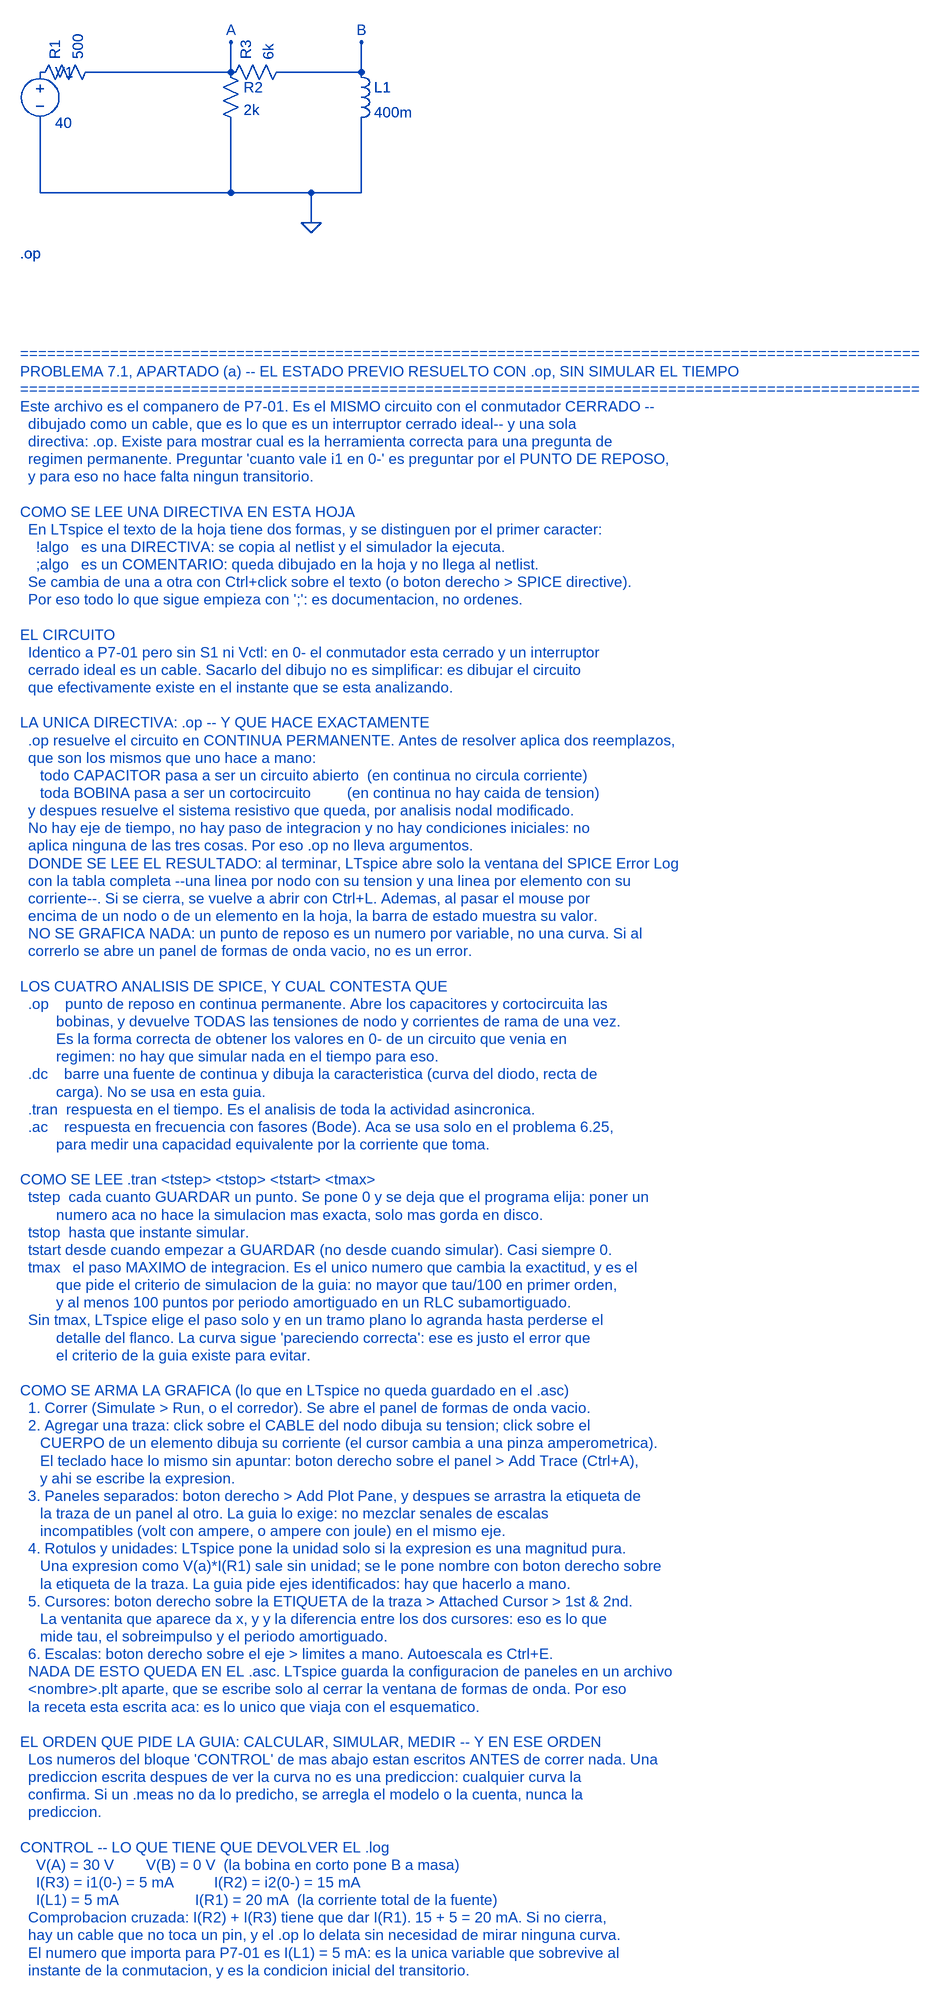
[diagram p0: schematic P7-01b_estado_previo_con_op.asc]
P7-01b_estado_previo_con_op.asc, the LTspice schematic file:
Version 4
SHEET 1 1800 1800
WIRE 96 192 96 304
WIRE 176 112 400 112
WIRE 400 192 400 304
WIRE 480 112 608 112
WIRE 608 192 608 304
WIRE 96 304 608 304
WIRE 528 304 528 352
WIRE 400 112 400 64
WIRE 608 112 608 64
FLAG 528 352 0
FLAG 400 64 A
FLAG 608 64 B
SYMBOL voltage 96 96 R0
WINDOW 123 0 0 Left 0
WINDOW 39 0 0 Left 0
SYMATTR InstName V1
SYMATTR Value 40
SYMBOL res 80 128 R270
SYMATTR InstName R1
SYMATTR Value 500
SYMBOL res 384 96 R0
SYMATTR InstName R2
SYMATTR Value 2k
SYMBOL res 384 128 R270
SYMATTR InstName R3
SYMATTR Value 6k
SYMBOL ind 592 96 R0
SYMATTR InstName L1
SYMATTR Value 400m
SYMATTR Value2 Rser=0
TEXT 64 400 Left 2 !.op
TEXT 64 560 Left 2 ;====================================================================================================
TEXT 64 588 Left 2 ;PROBLEMA 7.1, APARTADO (a) -- EL ESTADO PREVIO RESUELTO CON .op, SIN SIMULAR EL TIEMPO
TEXT 64 616 Left 2 ;====================================================================================================
TEXT 64 644 Left 2 ;Este archivo es el companero de P7-01. Es el MISMO circuito con el conmutador CERRADO --
TEXT 64 672 Left 2 ;  dibujado como un cable, que es lo que es un interruptor cerrado ideal-- y una sola
TEXT 64 700 Left 2 ;  directiva: .op. Existe para mostrar cual es la herramienta correcta para una pregunta de
TEXT 64 728 Left 2 ;  regimen permanente. Preguntar 'cuanto vale i1 en 0-' es preguntar por el PUNTO DE REPOSO,
TEXT 64 756 Left 2 ;  y para eso no hace falta ningun transitorio.
TEXT 64 784 Left 2 ;
TEXT 64 812 Left 2 ;COMO SE LEE UNA DIRECTIVA EN ESTA HOJA
TEXT 64 840 Left 2 ;  En LTspice el texto de la hoja tiene dos formas, y se distinguen por el primer caracter:
TEXT 64 868 Left 2 ;    !algo   es una DIRECTIVA: se copia al netlist y el simulador la ejecuta.
TEXT 64 896 Left 2 ;    ;algo   es un COMENTARIO: queda dibujado en la hoja y no llega al netlist.
TEXT 64 924 Left 2 ;  Se cambia de una a otra con Ctrl+click sobre el texto (o boton derecho > SPICE directive).
TEXT 64 952 Left 2 ;  Por eso todo lo que sigue empieza con ';': es documentacion, no ordenes.
TEXT 64 980 Left 2 ;
TEXT 64 1008 Left 2 ;EL CIRCUITO
TEXT 64 1036 Left 2 ;  Identico a P7-01 pero sin S1 ni Vctl: en 0- el conmutador esta cerrado y un interruptor
TEXT 64 1064 Left 2 ;  cerrado ideal es un cable. Sacarlo del dibujo no es simplificar: es dibujar el circuito
TEXT 64 1092 Left 2 ;  que efectivamente existe en el instante que se esta analizando.
TEXT 64 1120 Left 2 ;
TEXT 64 1148 Left 2 ;LA UNICA DIRECTIVA: .op -- Y QUE HACE EXACTAMENTE
TEXT 64 1176 Left 2 ;  .op resuelve el circuito en CONTINUA PERMANENTE. Antes de resolver aplica dos reemplazos,
TEXT 64 1204 Left 2 ;  que son los mismos que uno hace a mano:
TEXT 64 1232 Left 2 ;     todo CAPACITOR pasa a ser un circuito abierto  (en continua no circula corriente)
TEXT 64 1260 Left 2 ;     toda BOBINA pasa a ser un cortocircuito         (en continua no hay caida de tension)
TEXT 64 1288 Left 2 ;  y despues resuelve el sistema resistivo que queda, por analisis nodal modificado.
TEXT 64 1316 Left 2 ;  No hay eje de tiempo, no hay paso de integracion y no hay condiciones iniciales: no
TEXT 64 1344 Left 2 ;  aplica ninguna de las tres cosas. Por eso .op no lleva argumentos.
TEXT 64 1372 Left 2 ;  DONDE SE LEE EL RESULTADO: al terminar, LTspice abre solo la ventana del SPICE Error Log
TEXT 64 1400 Left 2 ;  con la tabla completa --una linea por nodo con su tension y una linea por elemento con su
TEXT 64 1428 Left 2 ;  corriente--. Si se cierra, se vuelve a abrir con Ctrl+L. Ademas, al pasar el mouse por
TEXT 64 1456 Left 2 ;  encima de un nodo o de un elemento en la hoja, la barra de estado muestra su valor.
TEXT 64 1484 Left 2 ;  NO SE GRAFICA NADA: un punto de reposo es un numero por variable, no una curva. Si al
TEXT 64 1512 Left 2 ;  correrlo se abre un panel de formas de onda vacio, no es un error.
TEXT 64 1540 Left 2 ;
TEXT 64 1568 Left 2 ;LOS CUATRO ANALISIS DE SPICE, Y CUAL CONTESTA QUE
TEXT 64 1596 Left 2 ;  .op    punto de reposo en continua permanente. Abre los capacitores y cortocircuita las
TEXT 64 1624 Left 2 ;         bobinas, y devuelve TODAS las tensiones de nodo y corrientes de rama de una vez.
TEXT 64 1652 Left 2 ;         Es la forma correcta de obtener los valores en 0- de un circuito que venia en
TEXT 64 1680 Left 2 ;         regimen: no hay que simular nada en el tiempo para eso.
TEXT 64 1708 Left 2 ;  .dc    barre una fuente de continua y dibuja la caracteristica (curva del diodo, recta de
TEXT 64 1736 Left 2 ;         carga). No se usa en esta guia.
TEXT 64 1764 Left 2 ;  .tran  respuesta en el tiempo. Es el analisis de toda la actividad asincronica.
TEXT 64 1792 Left 2 ;  .ac    respuesta en frecuencia con fasores (Bode). Aca se usa solo en el problema 6.25,
TEXT 64 1820 Left 2 ;         para medir una capacidad equivalente por la corriente que toma.
TEXT 64 1848 Left 2 ;
TEXT 64 1876 Left 2 ;COMO SE LEE .tran <tstep> <tstop> <tstart> <tmax>
TEXT 64 1904 Left 2 ;  tstep  cada cuanto GUARDAR un punto. Se pone 0 y se deja que el programa elija: poner un
TEXT 64 1932 Left 2 ;         numero aca no hace la simulacion mas exacta, solo mas gorda en disco.
TEXT 64 1960 Left 2 ;  tstop  hasta que instante simular.
TEXT 64 1988 Left 2 ;  tstart desde cuando empezar a GUARDAR (no desde cuando simular). Casi siempre 0.
TEXT 64 2016 Left 2 ;  tmax   el paso MAXIMO de integracion. Es el unico numero que cambia la exactitud, y es el
TEXT 64 2044 Left 2 ;         que pide el criterio de simulacion de la guia: no mayor que tau/100 en primer orden,
TEXT 64 2072 Left 2 ;         y al menos 100 puntos por periodo amortiguado en un RLC subamortiguado.
TEXT 64 2100 Left 2 ;  Sin tmax, LTspice elige el paso solo y en un tramo plano lo agranda hasta perderse el
TEXT 64 2128 Left 2 ;         detalle del flanco. La curva sigue 'pareciendo correcta': ese es justo el error que
TEXT 64 2156 Left 2 ;         el criterio de la guia existe para evitar.
TEXT 64 2184 Left 2 ;
TEXT 64 2212 Left 2 ;COMO SE ARMA LA GRAFICA (lo que en LTspice no queda guardado en el .asc)
TEXT 64 2240 Left 2 ;  1. Correr (Simulate > Run, o el corredor). Se abre el panel de formas de onda vacio.
TEXT 64 2268 Left 2 ;  2. Agregar una traza: click sobre el CABLE del nodo dibuja su tension; click sobre el
TEXT 64 2296 Left 2 ;     CUERPO de un elemento dibuja su corriente (el cursor cambia a una pinza amperometrica).
TEXT 64 2324 Left 2 ;     El teclado hace lo mismo sin apuntar: boton derecho sobre el panel > Add Trace (Ctrl+A),
TEXT 64 2352 Left 2 ;     y ahi se escribe la expresion.
TEXT 64 2380 Left 2 ;  3. Paneles separados: boton derecho > Add Plot Pane, y despues se arrastra la etiqueta de
TEXT 64 2408 Left 2 ;     la traza de un panel al otro. La guia lo exige: no mezclar senales de escalas
TEXT 64 2436 Left 2 ;     incompatibles (volt con ampere, o ampere con joule) en el mismo eje.
TEXT 64 2464 Left 2 ;  4. Rotulos y unidades: LTspice pone la unidad solo si la expresion es una magnitud pura.
TEXT 64 2492 Left 2 ;     Una expresion como V(a)*I(R1) sale sin unidad; se le pone nombre con boton derecho sobre
TEXT 64 2520 Left 2 ;     la etiqueta de la traza. La guia pide ejes identificados: hay que hacerlo a mano.
TEXT 64 2548 Left 2 ;  5. Cursores: boton derecho sobre la ETIQUETA de la traza > Attached Cursor > 1st & 2nd.
TEXT 64 2576 Left 2 ;     La ventanita que aparece da x, y y la diferencia entre los dos cursores: eso es lo que
TEXT 64 2604 Left 2 ;     mide tau, el sobreimpulso y el periodo amortiguado.
TEXT 64 2632 Left 2 ;  6. Escalas: boton derecho sobre el eje > limites a mano. Autoescala es Ctrl+E.
TEXT 64 2660 Left 2 ;  NADA DE ESTO QUEDA EN EL .asc. LTspice guarda la configuracion de paneles en un archivo
TEXT 64 2688 Left 2 ;  <nombre>.plt aparte, que se escribe solo al cerrar la ventana de formas de onda. Por eso
TEXT 64 2716 Left 2 ;  la receta esta escrita aca: es lo unico que viaja con el esquematico.
TEXT 64 2744 Left 2 ;
TEXT 64 2772 Left 2 ;EL ORDEN QUE PIDE LA GUIA: CALCULAR, SIMULAR, MEDIR -- Y EN ESE ORDEN
TEXT 64 2800 Left 2 ;  Los numeros del bloque 'CONTROL' de mas abajo estan escritos ANTES de correr nada. Una
TEXT 64 2828 Left 2 ;  prediccion escrita despues de ver la curva no es una prediccion: cualquier curva la
TEXT 64 2856 Left 2 ;  confirma. Si un .meas no da lo predicho, se arregla el modelo o la cuenta, nunca la
TEXT 64 2884 Left 2 ;  prediccion.
TEXT 64 2912 Left 2 ;
TEXT 64 2940 Left 2 ;CONTROL -- LO QUE TIENE QUE DEVOLVER EL .log
TEXT 64 2968 Left 2 ;    V(A) = 30 V        V(B) = 0 V  (la bobina en corto pone B a masa)
TEXT 64 2996 Left 2 ;    I(R3) = i1(0-) = 5 mA          I(R2) = i2(0-) = 15 mA
TEXT 64 3024 Left 2 ;    I(L1) = 5 mA                   I(R1) = 20 mA  (la corriente total de la fuente)
TEXT 64 3052 Left 2 ;  Comprobacion cruzada: I(R2) + I(R3) tiene que dar I(R1). 15 + 5 = 20 mA. Si no cierra,
TEXT 64 3080 Left 2 ;  hay un cable que no toca un pin, y el .op lo delata sin necesidad de mirar ninguna curva.
TEXT 64 3108 Left 2 ;  El numero que importa para P7-01 es I(L1) = 5 mA: es la unica variable que sobrevive al
TEXT 64 3136 Left 2 ;  instante de la conmutacion, y es la condicion inicial del transitorio.

The netlist it stands for:
* P7-01b_estado_previo_con_op.asc
V1 P001 0 40
R1 P001 A 500
R2 A 0 2k
R3 A B 6k
L1 B 0 400m Rser=0
.op
* ====================================================================================================
* PROBLEMA 7.1, APARTADO (a) -- EL ESTADO PREVIO RESUELTO CON .op, SIN SIMULAR EL TIEMPO
* ====================================================================================================
* Este archivo es el companero de P7-01. Es el MISMO circuito con el conmutador CERRADO --
*   dibujado como un cable, que es lo que es un interruptor cerrado ideal-- y una sola
*   directiva: .op. Existe para mostrar cual es la herramienta correcta para una pregunta de
*   regimen permanente. Preguntar 'cuanto vale i1 en 0-' es preguntar por el PUNTO DE REPOSO,
*   y para eso no hace falta ningun transitorio.
* COMO SE LEE UNA DIRECTIVA EN ESTA HOJA
*   En LTspice el texto de la hoja tiene dos formas, y se distinguen por el primer caracter:
*     !algo   es una DIRECTIVA: se copia al netlist y el simulador la ejecuta.
*     ;algo   es un COMENTARIO: queda dibujado en la hoja y no llega al netlist.
*   Se cambia de una a otra con Ctrl+click sobre el texto (o boton derecho > SPICE directive).
*   Por eso todo lo que sigue empieza con ';': es documentacion, no ordenes.
* EL CIRCUITO
*   Identico a P7-01 pero sin S1 ni Vctl: en 0- el conmutador esta cerrado y un interruptor
*   cerrado ideal es un cable. Sacarlo del dibujo no es simplificar: es dibujar el circuito
*   que efectivamente existe en el instante que se esta analizando.
* LA UNICA DIRECTIVA: .op -- Y QUE HACE EXACTAMENTE
*   .op resuelve el circuito en CONTINUA PERMANENTE. Antes de resolver aplica dos reemplazos,
*   que son los mismos que uno hace a mano:
*      todo CAPACITOR pasa a ser un circuito abierto  (en continua no circula corriente)
*      toda BOBINA pasa a ser un cortocircuito         (en continua no hay caida de tension)
*   y despues resuelve el sistema resistivo que queda, por analisis nodal modificado.
*   No hay eje de tiempo, no hay paso de integracion y no hay condiciones iniciales: no
*   aplica ninguna de las tres cosas. Por eso .op no lleva argumentos.
*   DONDE SE LEE EL RESULTADO: al terminar, LTspice abre solo la ventana del SPICE Error Log
*   con la tabla completa --una linea por nodo con su tension y una linea por elemento con su
*   corriente--. Si se cierra, se vuelve a abrir con Ctrl+L. Ademas, al pasar el mouse por
*   encima de un nodo o de un elemento en la hoja, la barra de estado muestra su valor.
*   NO SE GRAFICA NADA: un punto de reposo es un numero por variable, no una curva. Si al
*   correrlo se abre un panel de formas de onda vacio, no es un error.
* LOS CUATRO ANALISIS DE SPICE, Y CUAL CONTESTA QUE
*   .op    punto de reposo en continua permanente. Abre los capacitores y cortocircuita las
*          bobinas, y devuelve TODAS las tensiones de nodo y corrientes de rama de una vez.
*          Es la forma correcta de obtener los valores en 0- de un circuito que venia en
*          regimen: no hay que simular nada en el tiempo para eso.
*   .dc    barre una fuente de continua y dibuja la caracteristica (curva del diodo, recta de
*          carga). No se usa en esta guia.
*   .tran  respuesta en el tiempo. Es el analisis de toda la actividad asincronica.
*   .ac    respuesta en frecuencia con fasores (Bode). Aca se usa solo en el problema 6.25,
*          para medir una capacidad equivalente por la corriente que toma.
* COMO SE LEE .tran <tstep> <tstop> <tstart> <tmax>
*   tstep  cada cuanto GUARDAR un punto. Se pone 0 y se deja que el programa elija: poner un
*          numero aca no hace la simulacion mas exacta, solo mas gorda en disco.
*   tstop  hasta que instante simular.
*   tstart desde cuando empezar a GUARDAR (no desde cuando simular). Casi siempre 0.
*   tmax   el paso MAXIMO de integracion. Es el unico numero que cambia la exactitud, y es el
*          que pide el criterio de simulacion de la guia: no mayor que tau/100 en primer orden,
*          y al menos 100 puntos por periodo amortiguado en un RLC subamortiguado.
*   Sin tmax, LTspice elige el paso solo y en un tramo plano lo agranda hasta perderse el
*          detalle del flanco. La curva sigue 'pareciendo correcta': ese es justo el error que
*          el criterio de la guia existe para evitar.
* COMO SE ARMA LA GRAFICA (lo que en LTspice no queda guardado en el .asc)
*   1. Correr (Simulate > Run, o el corredor). Se abre el panel de formas de onda vacio.
*   2. Agregar una traza: click sobre el CABLE del nodo dibuja su tension; click sobre el
*      CUERPO de un elemento dibuja su corriente (el cursor cambia a una pinza amperometrica).
*      El teclado hace lo mismo sin apuntar: boton derecho sobre el panel > Add Trace (Ctrl+A),
*      y ahi se escribe la expresion.
*   3. Paneles separados: boton derecho > Add Plot Pane, y despues se arrastra la etiqueta de
*      la traza de un panel al otro. La guia lo exige: no mezclar senales de escalas
*      incompatibles (volt con ampere, o ampere con joule) en el mismo eje.
*   4. Rotulos y unidades: LTspice pone la unidad solo si la expresion es una magnitud pura.
*      Una expresion como V(a)*I(R1) sale sin unidad; se le pone nombre con boton derecho sobre
*      la etiqueta de la traza. La guia pide ejes identificados: hay que hacerlo a mano.
*   5. Cursores: boton derecho sobre la ETIQUETA de la traza > Attached Cursor > 1st & 2nd.
*      La ventanita que aparece da x, y y la diferencia entre los dos cursores: eso es lo que
*      mide tau, el sobreimpulso y el periodo amortiguado.
*   6. Escalas: boton derecho sobre el eje > limites a mano. Autoescala es Ctrl+E.
*   NADA DE ESTO QUEDA EN EL .asc. LTspice guarda la configuracion de paneles en un archivo
*   <nombre>.plt aparte, que se escribe solo al cerrar la ventana de formas de onda. Por eso
*   la receta esta escrita aca: es lo unico que viaja con el esquematico.
* EL ORDEN QUE PIDE LA GUIA: CALCULAR, SIMULAR, MEDIR -- Y EN ESE ORDEN
*   Los numeros del bloque 'CONTROL' de mas abajo estan escritos ANTES de correr nada. Una
*   prediccion escrita despues de ver la curva no es una prediccion: cualquier curva la
*   confirma. Si un .meas no da lo predicho, se arregla el modelo o la cuenta, nunca la
*   prediccion.
* CONTROL -- LO QUE TIENE QUE DEVOLVER EL .log
*     V(A) = 30 V        V(B) = 0 V  (la bobina en corto pone B a masa)
*     I(R3) = i1(0-) = 5 mA          I(R2) = i2(0-) = 15 mA
*     I(L1) = 5 mA                   I(R1) = 20 mA  (la corriente total de la fuente)
*   Comprobacion cruzada: I(R2) + I(R3) tiene que dar I(R1). 15 + 5 = 20 mA. Si no cierra,
*   hay un cable que no toca un pin, y el .op lo delata sin necesidad de mirar ninguna curva.
*   El numero que importa para P7-01 es I(L1) = 5 mA: es la unica variable que sobrevive al
*   instante de la conmutacion, y es la condicion inicial del transitorio.
.backanno
.end